# EAGLE schematic standalone_temp_controller (EAGLE 6.6.0)
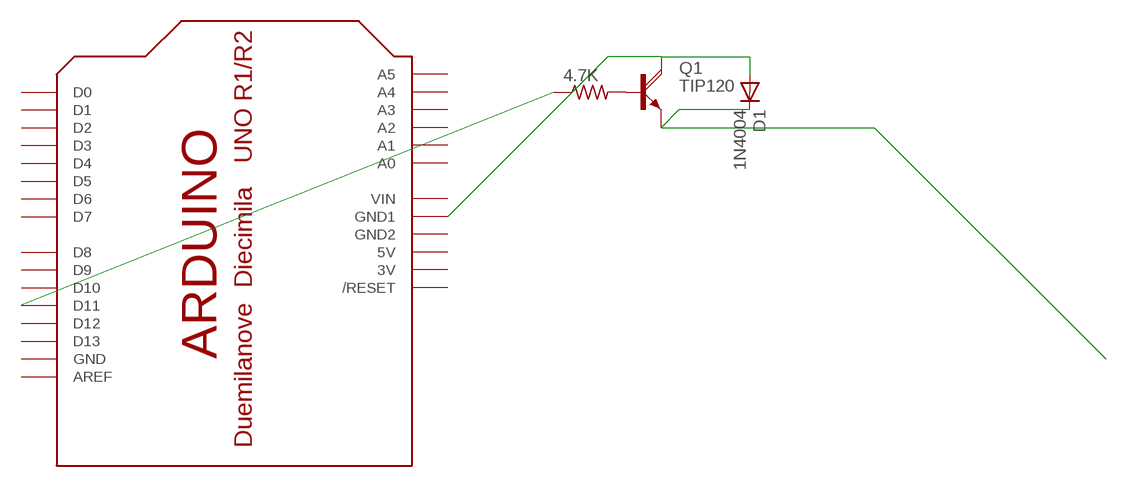
[diagram p0: schematic, sheet 1]

## Parts
4.7K  R-US_0204/7  [0204/7]
D1  1N4004  [DO41-10]
Q1  TIP120  [TO220AH]
U$1  ARDUINOUNO  [ARDUINO]

## Nets
N$1: 4.7K.2 Q1.B
N$2: D1.A Q1.C U$1.GND1
N$3: D1.C Q1.E
N$4: 4.7K.1 U$1.D11
Unconnected: U$1.A0 U$1.A1 U$1.A2 U$1.A3 U$1.A4 U$1.A5 U$1.AREF U$1.D0 U$1.D1 U$1.D2 U$1.D3 U$1.D4 U$1.D5 U$1.D6 U$1.D7 U$1.D8 U$1.D9 U$1.D10 U$1.D12 U$1.D13 U$1.RESET(/RESET)

## Power pins joined to a net without a drawn wire
3V: U$1.3V
5V: U$1.5V
GND: U$1.GND
GND2: U$1.GND2
VIN: U$1.VIN

## Library data of the parts
4.7K = adafruit:R-US_: RESISTOR, American symbol
D1 = adafruit:1N4004: DIODE General purpose 1N400x type rectifier (With bigger pads) http://www.ladyada.net/library/pcb/eaglelibrary.html
Q1 = transistor-power:TIP120: NPN DARLINGTON TRANSISTOR
U$1 = adafruit:ARDUINO: Arduino Diecimila/Duemilanove Make a shield with ease, this package has all the named pins as well as the two mounting drill holes and an outline of the USB and DC power connector. The outline is on the DIMENSION layer, so if your board house uses it they will cut the outline to match. http://www.ladyada.net/library/pcb/eaglelibrary.html